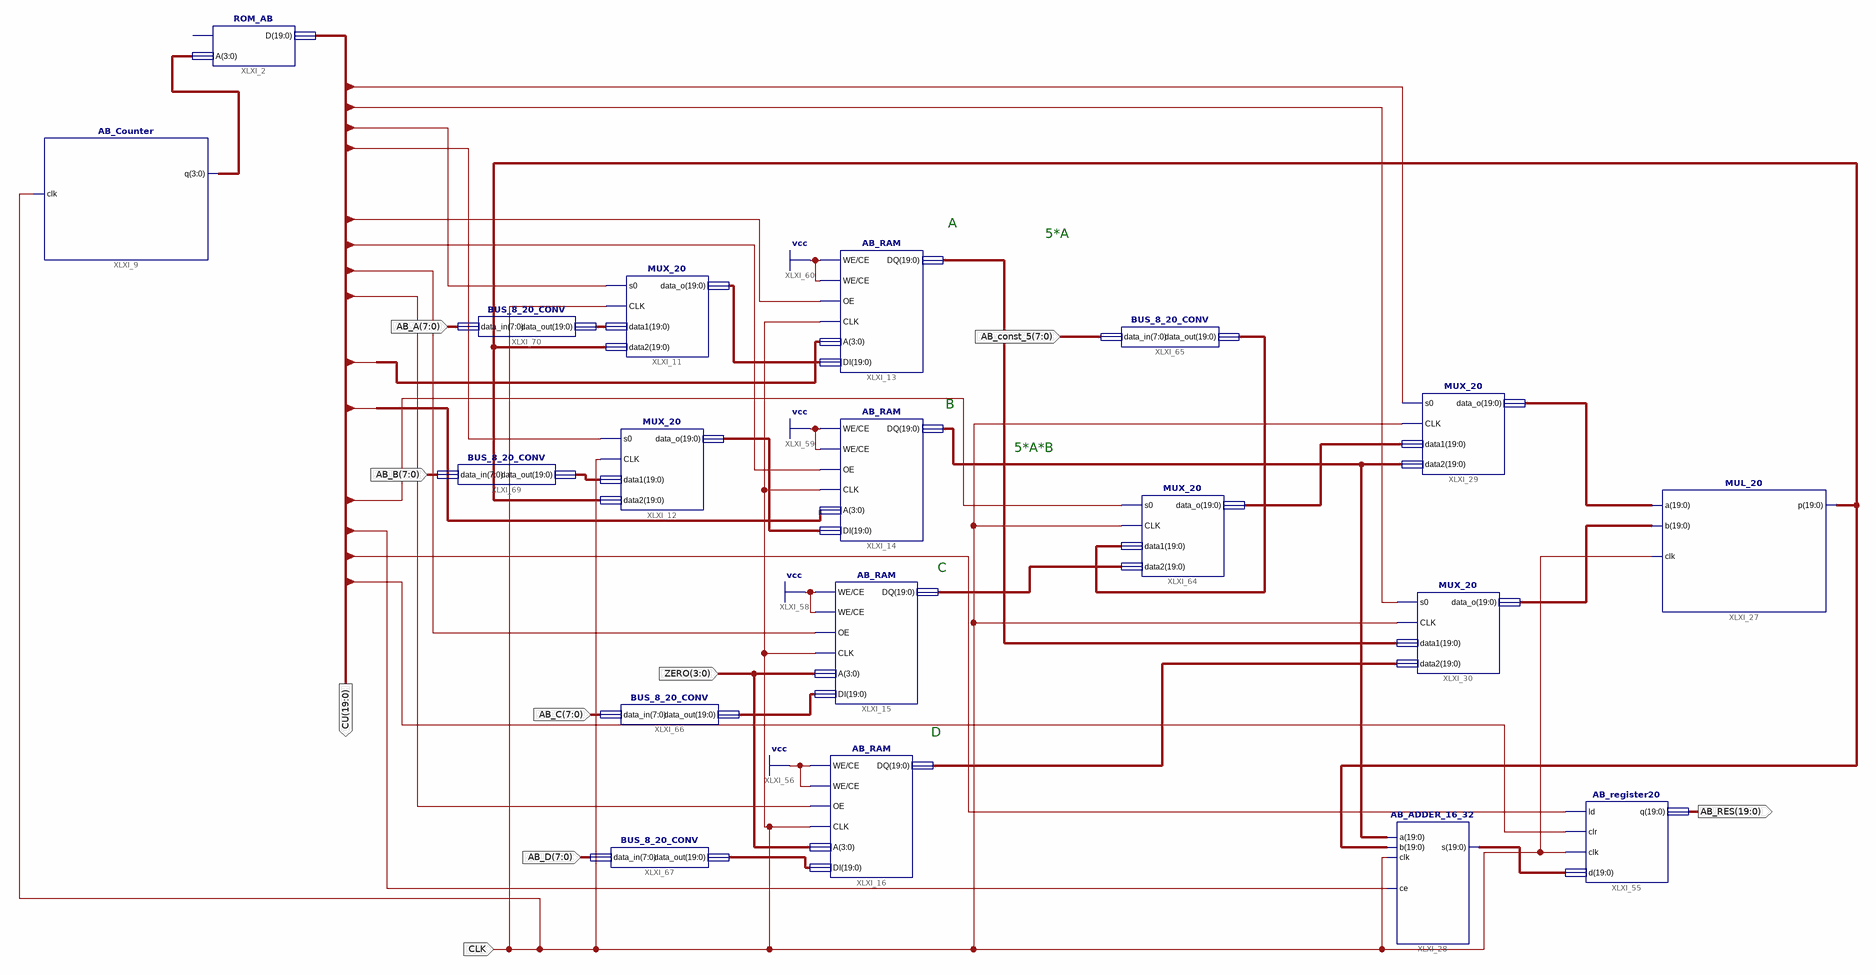
[diagram p0: schematic sheet 1]
// Xilinx ISE schematic AB_not_conv_scheme.sch (virtex7) as structural Verilog: 19 symbols, 9 ports
module AB_not_conv_scheme (
  input  [7:0] AB_const_5,
  input  [3:0] ZERO,
  input  CLK,
  input  [7:0] AB_C,
  input  [7:0] AB_D,
  input  [7:0] AB_B,
  input  [7:0] AB_A,
  output [19:0] AB_RES,
  output [19:0] CU
);

  wire [3:0] XLXN_52;
  wire [19:0] ADDER_OUT, const_buf, MUL_OUT_ADDER_B, MUX1_OUT, MUX2_OUT, MUX3_OUT, MUX4_OUT, MUX5_OUT,
       RAM1_OUT, RAM2_OUT_ADDER_A, RAM3_OUT, RAM4_OUT, XLXN_100, XLXN_102, XLXN_105, XLXN_107;

  AB_RAM XLXI_14 (.WE(1'b1), .CE(1'b1), .OE(CU[14]), .CLK(CLK), .A(CU[7:4]), .DI(MUX4_OUT), .DQ(RAM2_OUT_ADDER_A));
  AB_RAM XLXI_15 (.WE(1'b1), .CE(1'b1), .OE(CU[13]), .CLK(CLK), .A(ZERO), .DI(XLXN_100), .DQ(RAM3_OUT));
  AB_RAM XLXI_16 (.WE(1'b1), .CE(1'b1), .OE(CU[12]), .CLK(CLK), .A(ZERO), .DI(XLXN_102), .DQ(RAM4_OUT));
  AB_RAM XLXI_13 (.WE(1'b1), .CE(1'b1), .OE(CU[15]), .CLK(CLK), .A(CU[11:8]), .DI(MUX3_OUT), .DQ(RAM1_OUT));
  MUX_20 XLXI_11 (.s0(CU[17]), .CLK(CLK), .data1(XLXN_107), .data2(MUL_OUT_ADDER_B), .data_o(MUX3_OUT));
  MUX_20 XLXI_12 (.s0(CU[16]), .CLK(CLK), .data1(XLXN_105), .data2(MUL_OUT_ADDER_B), .data_o(MUX4_OUT));
  MUX_20 XLXI_29 (.s0(CU[19]), .CLK(CLK), .data1(MUX5_OUT), .data2(RAM2_OUT_ADDER_A), .data_o(MUX1_OUT));
  MUL_20 XLXI_27 (.a(MUX1_OUT), .b(MUX2_OUT), .clk(CLK), .p(MUL_OUT_ADDER_B));
  MUX_20 XLXI_30 (.s0(CU[18]), .CLK(CLK), .data1(RAM1_OUT), .data2(RAM4_OUT), .data_o(MUX2_OUT));
  AB_ADDER_16_32 XLXI_28 (.a(RAM2_OUT_ADDER_A), .b(MUL_OUT_ADDER_B), .clk(CLK), .ce(CU[2]), .s(ADDER_OUT));
  AB_register20 XLXI_55 (.ld(CU[1]), .clr(CU[0]), .clk(CLK), .d(ADDER_OUT), .q(AB_RES));
  AB_Counter XLXI_9 (.clk(CLK), .q(XLXN_52));
  ROM_AB XLXI_2 (.A(XLXN_52), .D(CU));  // open: CLK
  MUX_20 XLXI_64 (.s0(CU[3]), .CLK(CLK), .data1(const_buf), .data2(RAM3_OUT), .data_o(MUX5_OUT));
  BUS_8_20_CONV XLXI_65 (.data_in(AB_const_5), .data_out(const_buf));
  BUS_8_20_CONV XLXI_66 (.data_in(AB_C), .data_out(XLXN_100));
  BUS_8_20_CONV XLXI_67 (.data_in(AB_D), .data_out(XLXN_102));
  BUS_8_20_CONV XLXI_69 (.data_in(AB_B), .data_out(XLXN_105));
  BUS_8_20_CONV XLXI_70 (.data_in(AB_A), .data_out(XLXN_107));

  // Notes on the sheet:
  //   A
  //   5*A
  //   B
  //   5*A*B
  //   C
  //   D
endmodule
